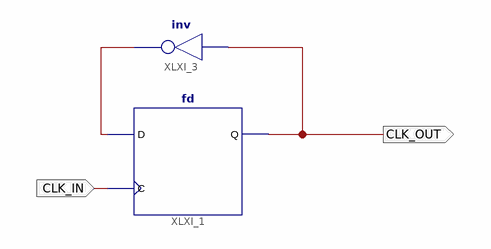
[diagram p0: schematic sheet 1]
// Xilinx ISE schematic devider2.sch (spartan6) as structural Verilog: 2 symbols, 2 ports
module devider2 (
  input  CLK_IN,
  output CLK_OUT
);

  wire XLXN_4;

  fd XLXI_1 (.C(CLK_IN), .D(XLXN_4), .Q(CLK_OUT));
  not XLXI_3 (XLXN_4, CLK_OUT);
endmodule
